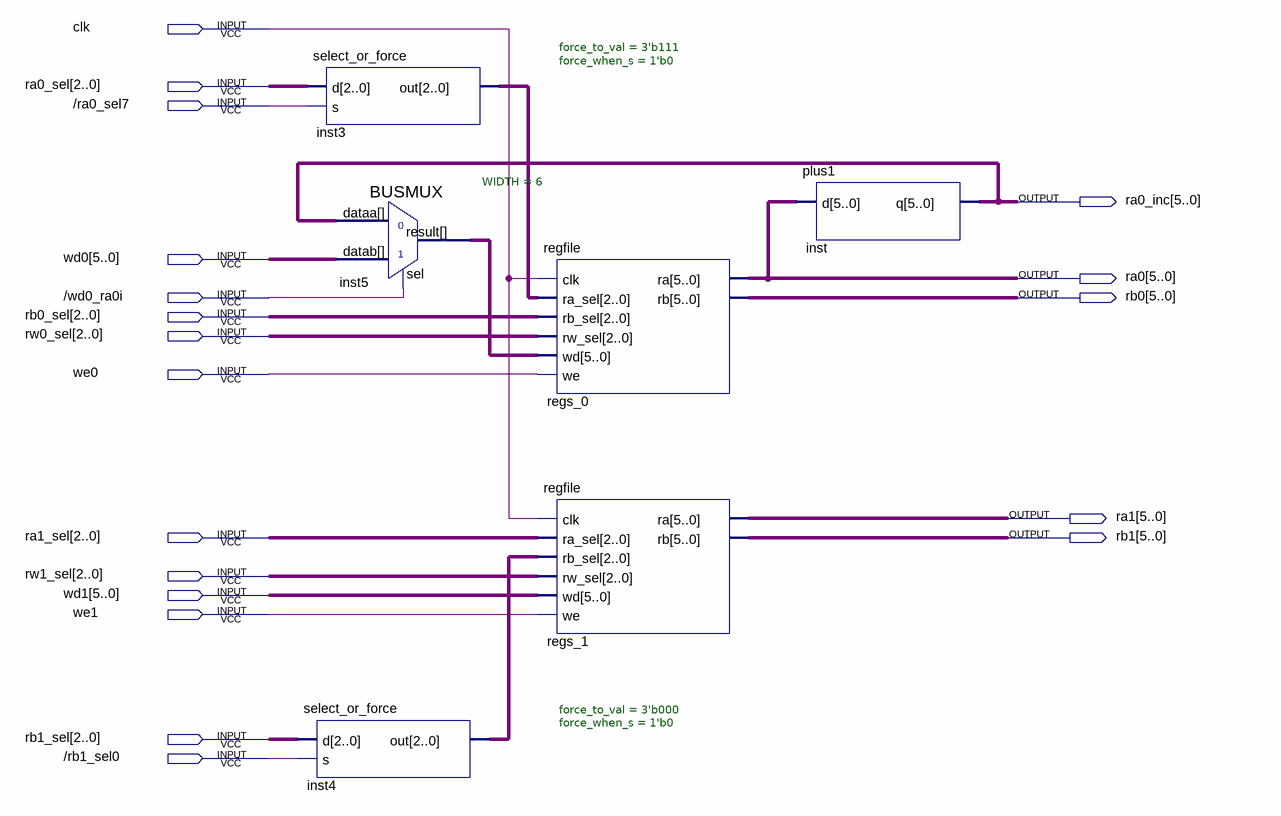
[diagram p0: schematic sheet]
// Quartus schematic c61registerset.bdf as structural Verilog: 6 symbols, 19 pins
module c61registerset (
  input  clk,
  input  [2:0] ra0_sel,
  input  \/ra0_sel7 ,
  input  [5:0] wd0,
  input  \/wd0_ra0i ,
  input  [2:0] rb0_sel,
  input  [2:0] rw0_sel,
  input  we0,
  input  [2:0] ra1_sel,
  input  [2:0] rw1_sel,
  input  [5:0] wd1,
  input  we1,
  input  [2:0] rb1_sel,
  input  \/rb1_sel0 ,
  output [5:0] ra0_inc,
  output [5:0] ra0,
  output [5:0] rb0,
  output [5:0] ra1,
  output [5:0] rb1
);

  wire [2:0] inst3_out, inst4_out;
  wire [5:0] inst5_result;

  select_or_force #(.force_to_val(3'b111), .force_when_s(1'b0)) inst3 (.d(ra0_sel), .s(\/ra0_sel7 ), .out(inst3_out));
  BUSMUX #(.WIDTH(6)) inst5 (.datab(wd0), .sel(\/wd0_ra0i ), .dataa(ra0_inc), .result(inst5_result));
  select_or_force #(.force_to_val(3'b000), .force_when_s(1'b0)) inst4 (.d(rb1_sel), .s(\/rb1_sel0 ), .out(inst4_out));
  regfile regs_0 (
    .clk(clk), .ra_sel(inst3_out), .rb_sel(rb0_sel), .rw_sel(rw0_sel), .wd(inst5_result), .we(we0), .ra(ra0),
    .rb(rb0));
  regfile regs_1 (
    .clk(clk), .ra_sel(ra1_sel), .rb_sel(inst4_out), .rw_sel(rw1_sel), .wd(wd1), .we(we1), .ra(ra1), .rb(rb1));
  plus1 inst (.d(ra0), .q(ra0_inc));
endmodule
